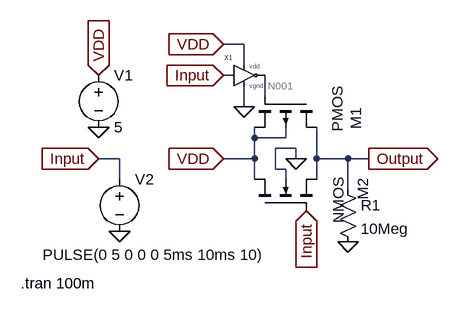
[diagram p0: schematic TransmissionGate.asc]
TransmissionGate.asc, the LTspice schematic file:
Version 4.1
SHEET 1 880 680
WIRE 128 -32 96 -32
WIRE 128 0 128 -32
WIRE 112 16 96 16
WIRE 160 48 160 16
WIRE 128 64 128 32
WIRE 144 112 144 96
WIRE 192 112 192 96
WIRE 192 112 144 112
WIRE 208 128 176 128
WIRE -64 144 -96 144
WIRE 144 144 144 112
WIRE 144 144 96 144
WIRE 208 144 208 128
WIRE 240 144 240 96
WIRE 288 144 240 144
WIRE 320 144 288 144
WIRE 176 160 176 128
WIRE 192 160 176 160
WIRE -64 176 -64 144
WIRE 144 176 144 144
WIRE 192 176 192 160
WIRE 240 176 240 144
WIRE 288 192 288 144
FLAG 320 144 Output
IOPIN 320 144 Out
FLAG -96 96 0
FLAG -96 16 VDD
IOPIN -96 16 In
FLAG -64 256 0
FLAG 224 224 Input
IOPIN 224 224 In
FLAG 96 144 VDD
IOPIN 96 144 In
FLAG -96 144 Input
IOPIN -96 144 In
FLAG 128 64 0
FLAG 96 -32 VDD
IOPIN 96 -32 In
FLAG 96 16 Input
IOPIN 96 16 In
FLAG 288 272 0
FLAG 208 144 0
SYMBOL pmos4 240 48 R90
WINDOW 0 18 -60 Left 2
WINDOW 3 -15 -32 Left 2
SYMATTR InstName M1
SYMBOL nmos4 144 224 R270
WINDOW 0 16 167 Left 2
WINDOW 3 -20 129 Left 2
SYMATTR InstName M2
SYMBOL voltage -96 0 R0
WINDOW 123 0 0 Left 0
WINDOW 39 0 0 Left 0
SYMATTR InstName V1
SYMATTR Value 5
SYMBOL voltage -64 160 R0
WINDOW 3 -118 132 Left 2
WINDOW 123 0 0 Left 0
WINDOW 39 0 0 Left 0
SYMATTR Value PULSE(0 5 0 0 0 5ms 10ms 10)
SYMATTR InstName V2
SYMBOL res 272 176 R0
SYMATTR InstName R1
SYMATTR Value 10Meg
SYMBOL CMOS_Inverter 128 16 R0
SYMATTR InstName X1
TEXT -216 336 Left 2 !.tran 100m

The netlist it stands for:
* TransmissionGate.asc
M1 Output N001 VDD VDD PMOS
M2 VDD Input Output 0 NMOS
V1 VDD 0 5
V2 Input 0 PULSE(0 5 0 0 0 5ms 10ms 10)
R1 Output 0 10Meg
X§X1 Input N001 VDD 0 CMOS_Inverter  ; pins i o vdd vgnd
.model NMOS NMOS
.model PMOS PMOS
.lib standard.mos
.tran 100m
.backanno
.end

* Results of the author's LTspice run, read from the files saved beside the schematic
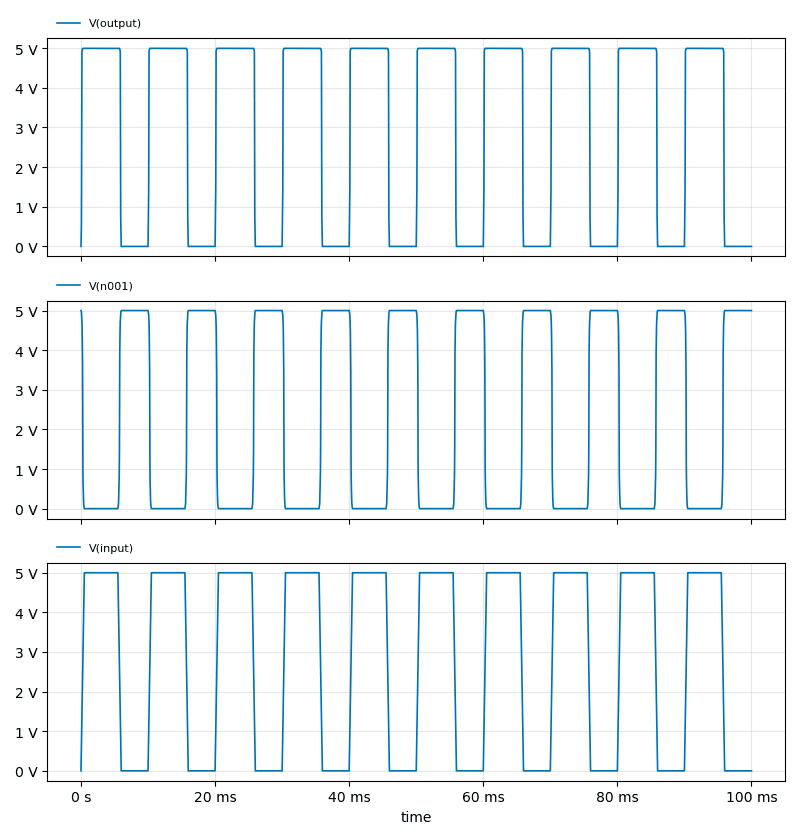
[diagram p1: Transient Analysis of TransmissionGate.asc, plotted from the saved traces]
* Transient Analysis, 1 run:
*   V(output): min 150.1 µV, max 4.995 V, average 2.897 V, rms 3.794 V, last 150.1 µV
*   V(n001): min 0 V, max 5 V, average 2.251 V, rms 3.329 V, last 5 V
*   V(input): min 0 V, max 5 V, average 2.75 V, rms 3.652 V, last 0 V